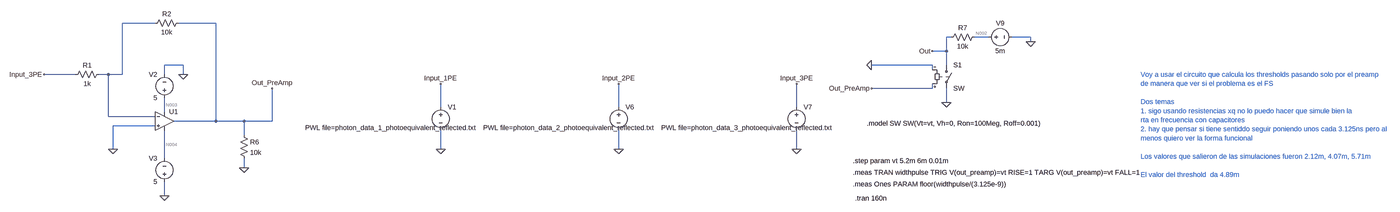
[diagram p0: schematic threshold_calculator_only_preamp.asc, whole sheet]
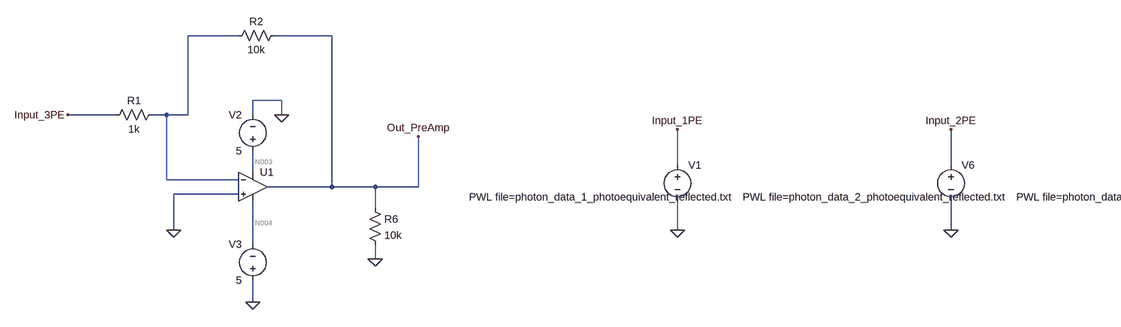
[diagram p1: schematic threshold_calculator_only_preamp.asc, part, row 1 of 1, column 1 of 2]
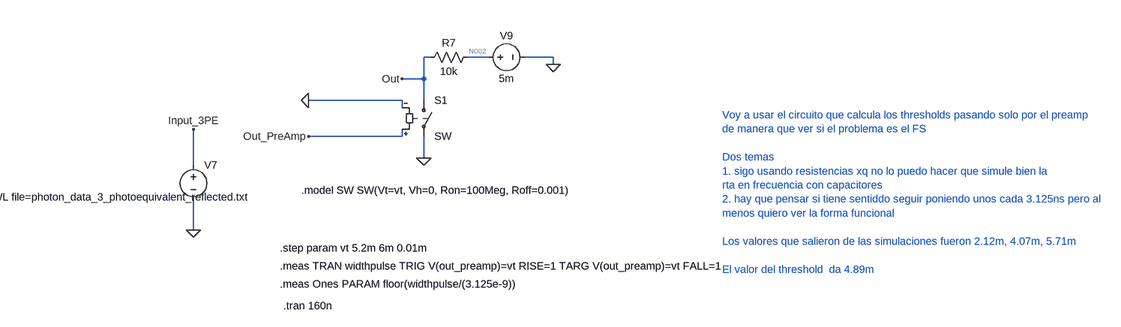
[diagram p2: schematic threshold_calculator_only_preamp.asc, part, row 1 of 1, column 2 of 2]
threshold_calculator_only_preamp.asc, the LTspice schematic file:
Version 4
SHEET 1 3940 852
WIRE -1152 -784 -1264 -784
WIRE -944 -784 -1072 -784
WIRE 1568 -736 1552 -736
WIRE 1696 -736 1648 -736
WIRE 1840 -736 1776 -736
WIRE 1840 -720 1840 -736
WIRE 1552 -688 1552 -736
WIRE 1552 -688 1504 -688
WIRE -1056 -640 -1120 -640
WIRE 1504 -640 1296 -640
WIRE 1552 -640 1552 -688
WIRE 1504 -624 1504 -640
WIRE -1424 -608 -1600 -608
WIRE -1312 -608 -1344 -608
WIRE -1264 -608 -1264 -784
WIRE -1264 -608 -1312 -608
WIRE -1120 -608 -1120 -640
WIRE -1056 -608 -1056 -640
WIRE 1504 -560 1504 -576
WIRE 1504 -560 1296 -560
WIRE 1552 -512 1552 -560
WIRE -176 -496 -176 -576
WIRE 432 -496 432 -576
WIRE 1040 -496 1040 -576
WIRE -1120 -480 -1120 -528
WIRE -1312 -464 -1312 -608
WIRE -1152 -464 -1312 -464
WIRE -944 -448 -944 -784
WIRE -944 -448 -1088 -448
WIRE -848 -448 -944 -448
WIRE -752 -448 -752 -560
WIRE -752 -448 -848 -448
WIRE -1152 -432 -1296 -432
WIRE -848 -400 -848 -448
WIRE -1296 -352 -1296 -432
WIRE -176 -352 -176 -416
WIRE 432 -352 432 -416
WIRE 1040 -352 1040 -416
WIRE -1120 -320 -1120 -416
WIRE -848 -288 -848 -320
WIRE -1120 -192 -1120 -240
FLAG -1120 -192 0
FLAG -1056 -608 0
FLAG -176 -352 0
FLAG -1296 -352 0
FLAG -752 -560 Out_PreAmp
FLAG -176 -576 Input_1PE
FLAG 432 -352 0
FLAG 432 -576 Input_2PE
FLAG -1600 -608 Input_3PE
FLAG -848 -288 0
FLAG 1040 -352 0
FLAG 1040 -576 Input_3PE
FLAG 1552 -512 0
FLAG 1840 -720 0
FLAG 1504 -688 Out
FLAG 1296 -640 0
FLAG 1296 -560 Out_PreAmp
SYMBOL res -1328 -624 R90
WINDOW 0 0 56 VBottom 2
WINDOW 3 32 56 VTop 2
SYMATTR InstName R1
SYMATTR Value 1k
SYMBOL res -1056 -800 R90
WINDOW 0 0 56 VBottom 2
WINDOW 3 32 56 VTop 2
SYMATTR InstName R2
SYMATTR Value 10k
SYMBOL voltage -1120 -512 R180
WINDOW 0 24 96 Left 2
WINDOW 3 24 16 Left 2
WINDOW 123 0 0 Left 0
WINDOW 39 0 0 Left 0
SYMATTR InstName V2
SYMATTR Value 5
SYMBOL voltage -1120 -224 R180
WINDOW 0 24 96 Left 2
WINDOW 3 24 16 Left 2
WINDOW 123 0 0 Left 0
WINDOW 39 0 0 Left 0
SYMATTR InstName V3
SYMATTR Value 5
SYMBOL OpAmps\\UniversalOpAmp1 -1120 -448 R0
SYMATTR InstName U1
SYMATTR Value2 Avol=1Meg GBW=100Meg Vos=0
SYMBOL voltage -176 -512 R0
WINDOW 3 -463 87 Left 2
WINDOW 123 0 0 Left 0
WINDOW 39 0 0 Left 0
SYMATTR Value PWL file=photon_data_1_photoequivalent_reflected.txt
SYMATTR InstName V1
SYMBOL voltage 432 -512 R0
WINDOW 3 -463 87 Left 2
WINDOW 123 0 0 Left 0
WINDOW 39 0 0 Left 0
SYMATTR Value PWL file=photon_data_2_photoequivalent_reflected.txt
SYMATTR InstName V6
SYMBOL res -864 -416 R0
SYMATTR InstName R6
SYMATTR Value 10k
SYMBOL voltage 1040 -512 R0
WINDOW 3 -463 87 Left 2
WINDOW 123 0 0 Left 0
WINDOW 39 0 0 Left 0
SYMATTR Value PWL file=photon_data_3_photoequivalent_reflected.txt
SYMATTR InstName V7
SYMBOL sw 1552 -656 R0
SYMATTR InstName S1
SYMBOL voltage 1680 -736 R270
WINDOW 0 32 56 VTop 2
WINDOW 3 -32 56 VBottom 2
WINDOW 123 0 0 Left 0
WINDOW 39 0 0 Left 0
SYMATTR InstName V9
SYMATTR Value 5m
SYMBOL res 1664 -752 R90
WINDOW 0 0 56 VBottom 2
WINDOW 3 32 56 VTop 2
SYMATTR InstName R7
SYMATTR Value 10k
TEXT 1240 -184 Left 2 !.tran 160n
TEXT 1280 -440 Left 2 !.model SW SW(Vt=vt, Vh=0, Ron=100Meg, Roff=0.001)
TEXT 1232 -312 Left 2 !.step param vt 5.2m 6m 0.01m
TEXT 1232 -232 Left 2 !.meas Ones PARAM floor(widthpulse/(3.125e-9))
TEXT 1232 -272 Left 2 !.meas TRAN widthpulse TRIG V(out_preamp)=vt RISE=1 TARG V(out_preamp)=vt FALL=1
TEXT 2216 -608 Left 2 ;Voy a usar el circuito que calcula los thresholds pasando solo por el preamp\nde manera que ver si el problema es el FS \n \nDos temas \n1. sigo usando resistencias xq no lo puedo hacer que simule bien la \nrta en frecuencia con capacitores \n2. hay que pensar si tiene sentiddo seguir poniendo unos cada 3.125ns pero al \nmenos quiero ver la forma funcional\n \nLos valores que salieron de las simulaciones fueron 2.12m, 4.07m, 5.71m\n \nEl valor del threshold  da 4.89m

The netlist it stands for:
* threshold_calculator_only_preamp.asc
R1 N001 Input_3PE 1k
R2 Out_PreAmp N001 10k
V2 N003 0 5
V3 0 N004 5
XU1 0 N001 N003 N004 Out_PreAmp level1 Avol=1Meg GBW=100Meg Vos=0 En=0 Enk=0 In=0 Ink=0 Rin=500Meg  ; pins In+ In- V+ V- OUT
V1 Input_1PE 0 PWL file=photon_data_1_photoequivalent_reflected.txt
V6 Input_2PE 0 PWL file=photon_data_2_photoequivalent_reflected.txt
R6 Out_PreAmp 0 10k
V7 Input_3PE 0 PWL file=photon_data_3_photoequivalent_reflected.txt
S1 Out 0 Out_PreAmp 0 SW
V9 N002 0 5m
R7 N002 Out 10k
.tran 160n
.model SW SW(Vt=vt, Vh=0, Ron=100Meg, Roff=0.001)
.step param vt 5.2m 6m 0.01m
.meas Ones PARAM floor(widthpulse/(3.125e-9))
.meas TRAN widthpulse TRIG V(out_preamp)=vt RISE=1 TARG V(out_preamp)=vt FALL=1
* Voy a usar el circuito que calcula los thresholds pasando solo por el preamp
* de manera que ver si el problema es el FS
* Dos temas
* 1. sigo usando resistencias xq no lo puedo hacer que simule bien la
* rta en frecuencia con capacitores
* 2. hay que pensar si tiene sentiddo seguir poniendo unos cada 3.125ns pero al
* menos quiero ver la forma funcional
* Los valores que salieron de las simulaciones fueron 2.12m, 4.07m, 5.71m
* El valor del threshold  da 4.89m
.lib UniversalOpAmp1.lib
.backanno
.end

* Results of the author's LTspice run, read from the files saved beside the schematic
* Operating Point (first step), zero values left out:
*   vt = 5.2 m
*   V(n003) = 5 V
*   V(n004) = -5 V
*   V(n002) = 5 mV
*   I(R7) = 500 nA
*   I(S1) = -500 nA
*   I(V2) = -10 nA
*   I(V3) = -10 nA
*   I(V9) = -500 nA
*   Ix(u1:3) = 10 nA
*   Ix(u1:4) = -10 nA
* From the log:
*   Measurement: ones
*     step  floor(widthpulse/(3.125e-9))
*        1  5
*        2  5
*        3  5
*        4  5
*        5  5
*        6  5
*        7  5
*        8  5
*        9  5
*       10  5
*       11  5
*       12  5
*       13  4
*       14  4
*       15  4
*       16  4
*       17  4
*       18  4
*       19  4
*       20  4
*       21  4
*       22  4
*       23  4
*       24  4
*       25  4
*       26  4
*       27  3
*       28  3
*       29  3
*       30  3
*       31  3
*       32  3
*       33  3
*       34  3
*       35  3
*       36  3
*       37  3
*       38  3
*       39  2
*       40  2
*     ...
*   Measurement: widthpulse
*     step  widthpulse  FROM  TO
*        1  1.76953e-08  1.13097e-08  2.9005e-08
*        2  1.75148e-08  1.13775e-08  2.88924e-08
*        3  1.7333e-08  1.1446e-08  2.8779e-08
*        4  1.71498e-08  1.15152e-08  2.8665e-08
*        5  1.69651e-08  1.15852e-08  2.85503e-08
*        6  1.67788e-08  1.16561e-08  2.84349e-08
*        7  1.6591e-08  1.17277e-08  2.83187e-08
*        8  1.64016e-08  1.18002e-08  2.82017e-08
*        9  1.62105e-08  1.18735e-08  2.8084e-08
*       10  1.60176e-08  1.19478e-08  2.79654e-08
*       11  1.58229e-08  1.2023e-08  2.78458e-08
*       12  1.56262e-08  1.20992e-08  2.77254e-08
*       13  1.54277e-08  1.21764e-08  2.76041e-08
*       14  1.52271e-08  1.22547e-08  2.74817e-08
*       15  1.50243e-08  1.2334e-08  2.73583e-08
*       16  1.48194e-08  1.24145e-08  2.72339e-08
*       17  1.46121e-08  1.24962e-08  2.71083e-08
*       18  1.44024e-08  1.25791e-08  2.69815e-08
*       19  1.41901e-08  1.26634e-08  2.68535e-08
*       20  1.39753e-08  1.27489e-08  2.67242e-08
*       21  1.37576e-08  1.2836e-08  2.65936e-08
*       22  1.35371e-08  1.29245e-08  2.64615e-08
*       23  1.33135e-08  1.30145e-08  2.6328e-08
*       24  1.30866e-08  1.31062e-08  2.61928e-08
*       25  1.28564e-08  1.31996e-08  2.6056e-08
*       26  1.26226e-08  1.32948e-08  2.59175e-08
*       27  1.2385e-08  1.3392e-08  2.5777e-08
*       28  1.21435e-08  1.34912e-08  2.56347e-08
*       29  1.18976e-08  1.35925e-08  2.54902e-08
*       30  1.16473e-08  1.36962e-08  2.53435e-08
*       31  1.13921e-08  1.38023e-08  2.51943e-08
*       32  1.11317e-08  1.3911e-08  2.50427e-08
*       33  1.08659e-08  1.40224e-08  2.48883e-08
*       34  1.0594e-08  1.4137e-08  2.4731e-08
*       35  1.03157e-08  1.42547e-08  2.45705e-08
*       36  1.00305e-08  1.4376e-08  2.44065e-08
*       37  9.73768e-09  1.45011e-08  2.42388e-08
*       38  9.43656e-09  1.46303e-08  2.40669e-08
*       39  9.12634e-09  1.47642e-08  2.38905e-08
*       40  8.80599e-09  1.49031e-08  2.37091e-08
*     ...